# EAGLE design electrovanne (EAGLE 7.6.0)
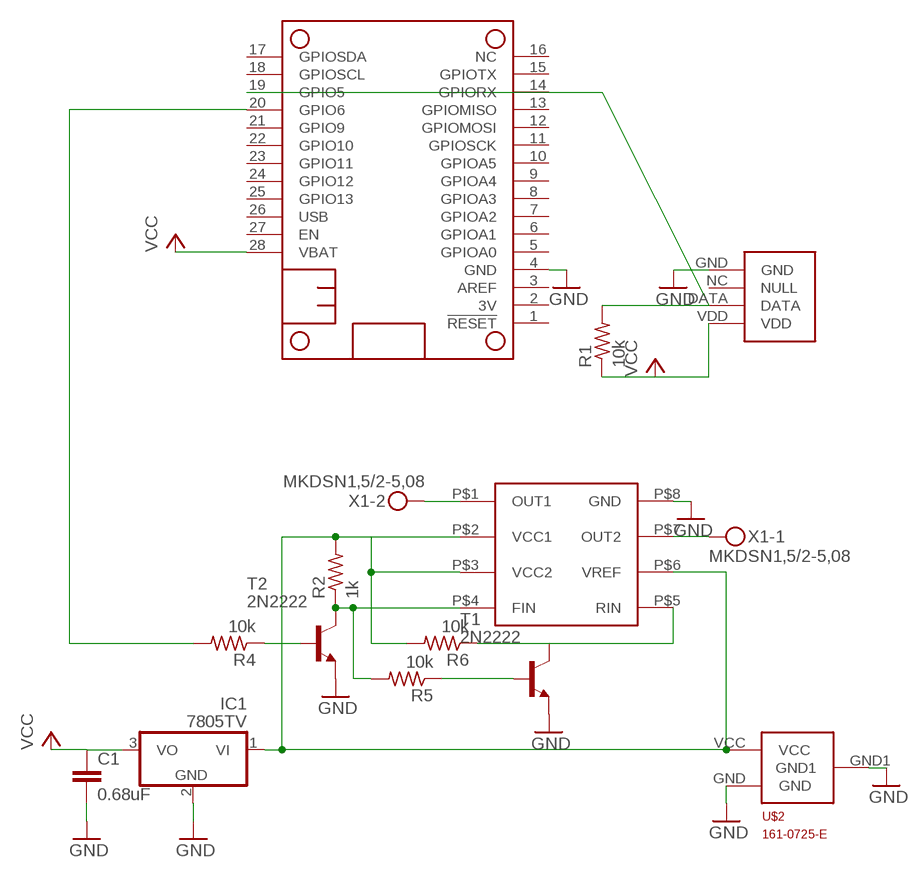
[diagram p0: schematic, sheet 1]

## Parts
C1  0.68uF  CAP0603-CAP  [0603-CAP]
IC1  7805TV  [TO220V]
MS1  FEATHERWING_NODIM  [FEATHERWING_DIM]
R1  10k  R-US_R0603  [R0603]
R2  1k  R-US_R0603  [R0603]
R4  10k  R-US_R0603  [R0603]
R5  10k  R-US_R0603  [R0603]
R6  10k  R-US_R0603  [R0603]
T1  2N2222  [TO18]
T2  2N2222  [TO18]
U$1  DHT22  [DHT22]
U$2  161-0725-E  [161-0725-E]
U$4  755-BD6211F-E2  [755-BD6211F-E2_DIM]
X1  MKDSN1,5/2-5,08  [MKDSN1,5/2-5,08]

## Nets
GND: C1.2 IC1.2(GND) MS1.4(GND) T1.1(E) T2.1(E) U$1.GND U$2.GND U$2.GND1 U$4.P$8(GND)
N$1: IC1.1(VI) R2.2 R6.2 U$2.VCC U$4.P$2(VCC1) U$4.P$3(VCC2) U$4.P$6(VREF)
N$2: R5.1 T1.2(B)
N$3: MS1.19(GPIO5) R1.2 U$1.DATA
N$4: U$4.P$1(OUT1) X1.2
N$6: U$4.P$7(OUT2) X1.1
N$7: MS1.20(GPIO6) R4.2
N$8: R2.1 R5.2 T2.3(C) U$4.P$4(FIN)
N$9: R4.1 T2.2(B)
N$10: R6.1 T1.3(C) U$4.P$5(RIN)
VCC: C1.1 IC1.3(VO) MS1.28(VBAT) R1.1 U$1.VDD
Unconnected: MS1.1(!RESET) MS1.2(3V) MS1.3(AREF) MS1.5(GPIOA0) MS1.6(GPIOA1) MS1.7(GPIOA2) MS1.8(GPIOA3) MS1.9(GPIOA4) MS1.10(GPIOA5) MS1.11(GPIOSCK) MS1.12(GPIOMOSI) MS1.13(GPIOMISO) MS1.14(GPIORX) MS1.15(GPIOTX) MS1.16(NC) MS1.17(GPIOSDA) MS1.18(GPIOSCL) MS1.21(GPIO9) MS1.22(GPIO10) MS1.23(GPIO11) MS1.24(GPIO12) MS1.25(GPIO13) MS1.26(USB) MS1.27(EN) U$1.NC(NULL)

## Library data of the parts
C1 = SparkFun-Capacitors:CAP: Capacitor Standard 0603 ceramic capacitor, and 0.1" leaded capacitor.
IC1 = linear:78*: Positive VOLTAGE REGULATOR Source: http://cache.national.com/ds/LM/LM78L05.pdf http://www.fairchildsemi.com/ds/LM/LM7805.pdf
MS1 = adafruit:FEATHERWING
R1 R2 R4-R6 = resistor:R-US_: RESISTOR, American symbol
T1 T2 = transistor:2N2222: NPN TRANSISTOR
U$1 = Spark:DHT22
U$2 = mouser:161-0725-E
U$4 = mouser:755-BD6211F-E2
X1 = con-phoenix-508:MKDSN1,5/2-5,08: MKDSN 1,5/ 2-5,08 Printklemme Nennstrom: 13,5 A Nennspannung: 250 V Rastermaß: 5,08 mm Polzahl: 2 Anschlussart: Schraubanschluss Montage: Löten Anschlussrichtung Leiter/Platine: 0 ° Artikelnummer: 1729128 Source: http://eshop.phoenixcontact.com .. 1729128.pdf

## Board
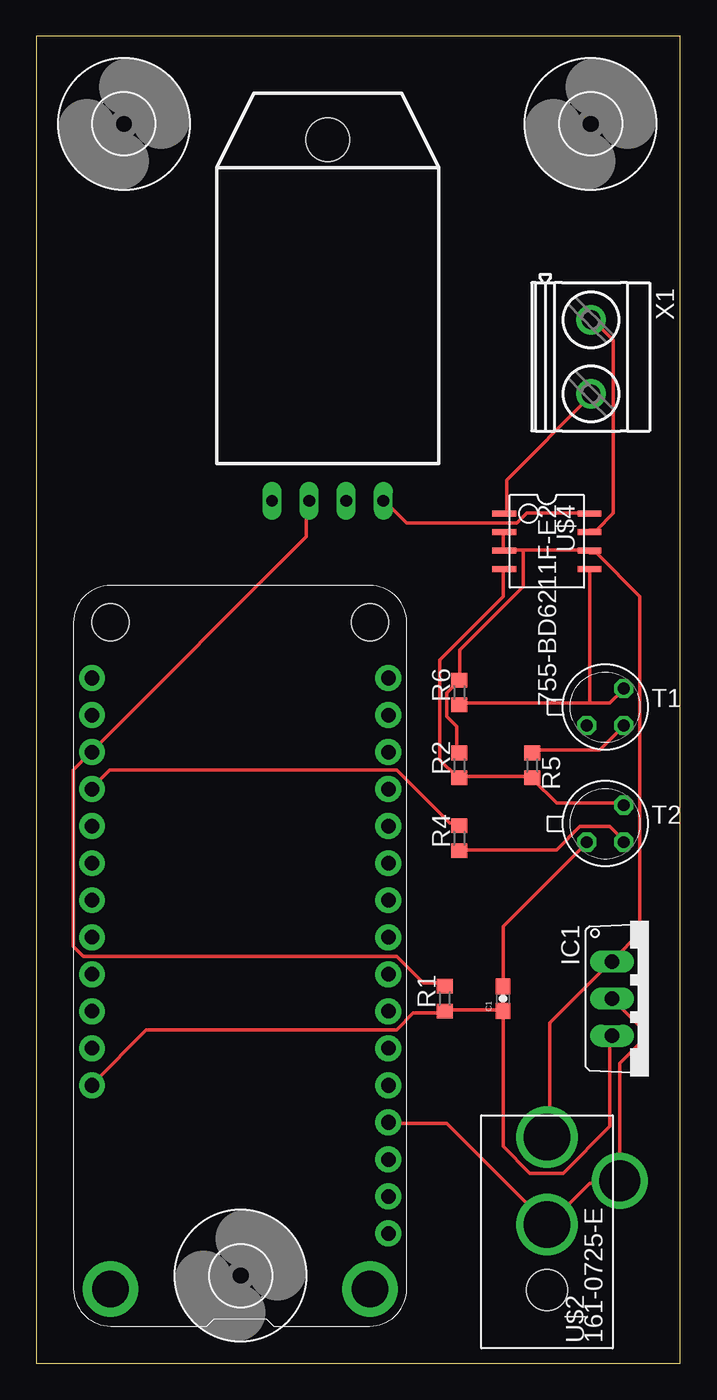
[diagram p1: board, top side]
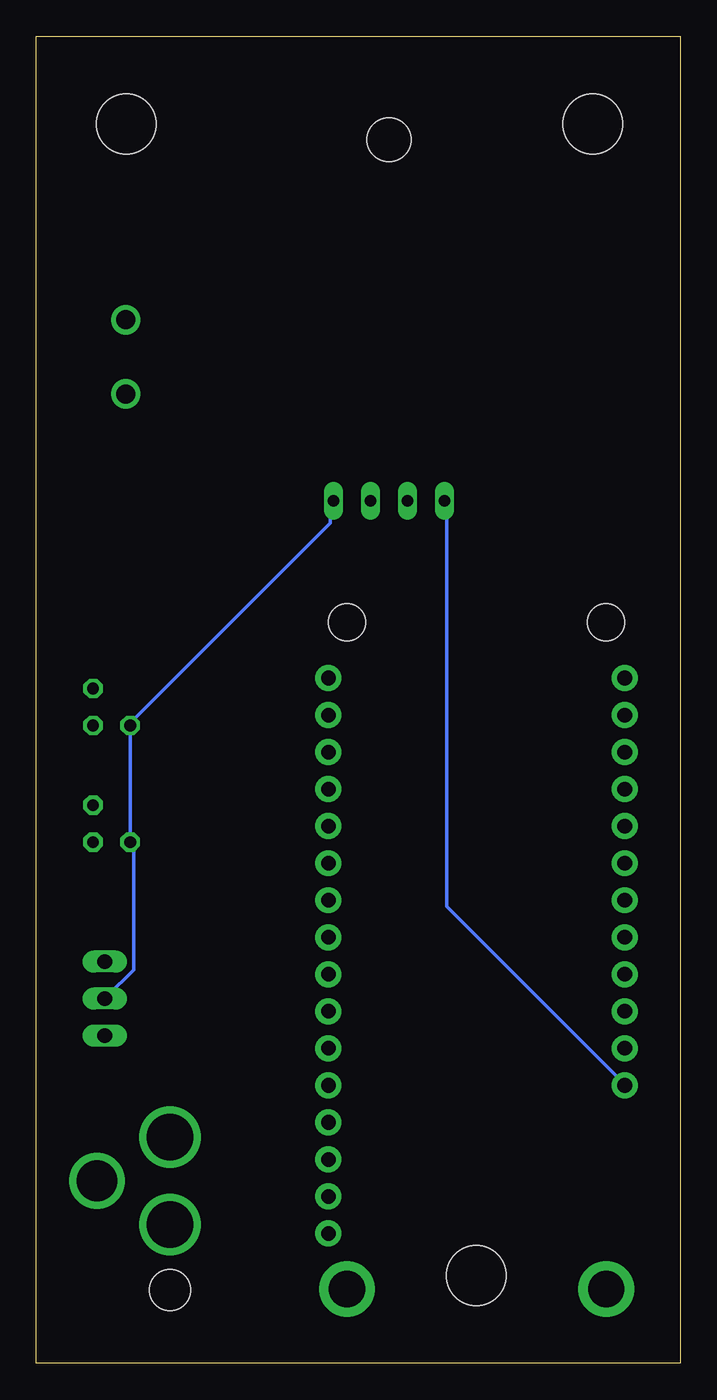
[diagram p2: board, bottom side, seen from below]

Size 44.15 x 91 mm. Coordinates in mm from the lower left corner, seen from the top.
Outline: 0,0 44.15,0 44.15,91 0,91 0,0
Copper layers (1*16): Top 0.035mm / dielectric 1.5mm / Bottom 0.035mm
Design rules "default": minimum track width 10mil, minimum drill 24mil, track to track 8mil, track to pad 8mil, pad to pad 8mil, via to via 8mil, smd to smd 8mil, copper to edge 40mil, drill to drill 8mil, minimum pad ring 10mil, minimum via ring 8mil, stop-mask expansion 4mil, vias tented up to drill 0mil, thermal gap 10mil

### Footprints (pad centres in the part's own frame; a part is rotated, then mirrored left to right if it is on the bottom)
0603-CAP = smd 1.1 x 1: 1 -0.85,0; 2 0.85,0
TO220V = drill 1.016 long: 1 -2.54,-2.54; 2 0,-2.54; 3 2.54,-2.54
FEATHERWING_DIM = drill 1 pad 1.778: 1 6.35,1.27; 2 8.89,1.27; 3 11.43,1.27; 4 13.97,1.27; 5 16.51,1.27; 6 19.05,1.27; 7 21.59,1.27; 8 24.13,1.27; 9 26.67,1.27; 10 29.21,1.27; 11 31.75,1.27; 12 34.29,1.27; 13 36.83,1.27; 14 39.37,1.27; 15 41.91,1.27; 16 44.45,1.27; 17 44.45,21.59; 18 41.91,21.59; 19 39.37,21.59; 20 36.83,21.59; 21 34.29,21.59; 22 31.75,21.59; 23 29.21,21.59; 24 26.67,21.59; 25 24.13,21.59; 26 21.59,21.59; 27 19.05,21.59; 28 16.51,21.59 | drill 2.5 pad 3.81: P$1 2.54,20.32; P$2 2.54,2.54 | hole 2.54: 48.26,20.32; 48.26,2.54
R0603 = smd 1 x 1.1: 1 -0.85,0; 2 0.85,0
TO18 = drill 0.813 octagon: 1 -1.27,-1.27; 2 1.27,-1.27; 3 1.27,1.27
DHT22 = drill 0.8 long: DATA -1.27,0; GND 3.81,0; NC 1.27,0; VDD -3.81,0 | hole 3: 0,24.765
161-0725-E = drill 3.2: GND 0.5,0; VCC 6.5,0 | drill 2.8: GND1 3.5,-5 | hole 2.8: -4,0
4,1 = hole 4.1: 0,0
755-BD6211F-E2_DIM = smd 0.406 x 1.626: P$1 -1.27,-2.921; P$2 0,-2.921; P$3 1.27,-2.921; P$4 2.54,-2.921; P$5 2.54,2.921; P$6 1.27,2.921; P$7 0,2.921; P$8 -1.27,2.921
MKDSN1,5/2-5,08 = drill 1.3 pad 2: 1 -2.561,0.025; 2 2.519,0.025

### Placement (x,y rotation side)
C1  32,25 90 top
IC1  42,25 270 top
MS1  25.4,2.54 90 top
R1  28,25 90 top
R2  29,41 90 top
R4  29,36 90 top
R5  34,41 270 top
R6  29,46 90 top
T1  39,45 0 top
T2  39,37 0 top
U$1  19.97,59.15 0 top
U$2  35,9 90 top
U$3  [4,1]  6,85 0 top
U$4  35,57 270 top
U$5  [4,1]  38,85 0 top
U$6  [4,1]  14,6 0 top
X1  38,69 270 top

### Tracks (layer width: path | path; a pad name or v marks a point on that pad's centre or on a via)
GND
  Top 0.254: MS1.4 24.23,16.46 28.12,16.46 34.98,9.6 U$2.GND 35.2,9.6 37.95,12.34 39.78,12.34 U$2.GND1 40.01,12.57 40.01,20.57 41.38,21.95 41.38,23.09 39.55,24.92 IC1.2 | U$4.P$8 37.72,58.29 33.6,58.29 32.92,57.61 25.38,57.61 24,58.98 U$1.GND | C1.2 32,26.06 32,29.95 37.72,35.66 T2.1
  Bottom 0.254: IC1.2 39.32,25.15 37.49,26.98 37.49,35.43 37.72,35.66 T2.1 37.72,35.89 37.72,43.66 T1.1 37.72,43.89 24,57.61 24,58.98 U$1.GND
N$1
  Top 0.254: R2.2 28.8,42.06 28.8,43.66 28.12,44.35 28.12,45.95 28.8,46.63 R6.2 29.03,46.86 29.03,48.92 33.38,53.26 33.38,55.78 | U$4.P$2 32,56.92 32,55.78 U$4.P$3 32.23,55.78 33.38,55.78 | 33.38,55.78 37.72,55.78 U$4.P$6 37.95,55.55 38.41,55.55 41.38,52.58 41.38,29.49 39.55,27.66 IC1.1 39.32,27.43 35.2,23.32 35.2,15.54 U$2.VCC
N$2
  Top 0.254: R5.1 34.06,42.06 38.63,42.06 40.23,43.66 T1.2
N$3
  Top 0.254: R1.2 27.89,26.06 26.52,26.06 24.69,27.89 3.2,27.89 2.52,28.57 2.52,40.69 3.66,41.83 MS1.19 3.89,42.06 18.52,56.69 18.52,58.98 U$1.DATA
N$4
  Top 0.254: U$4.P$1 32.23,58.29 32.23,60.58 37.95,66.29 X1.2
N$6
  Top 0.254: U$4.P$7 37.95,57.15 38.41,57.15 39.55,58.29 39.55,70.18 38.18,71.55 X1.1
N$7
  Top 0.254: R4.2 28.8,37.03 28.35,37.03 24.69,40.69 5.03,40.69 3.89,39.55 MS1.20
N$8
  Top 0.254: U$4.P$4 32,54.41 32,52.58 27.66,48.23 27.66,41.38 28.8,40.23 R2.1 29.03,40.23 33.83,40.23 R5.2 34.06,40.01 35.66,38.41 40.23,38.41 T2.3
N$9
  Top 0.254: R4.1 29.03,35.2 35.66,35.2 37.26,36.8 39.32,36.8 40.23,35.89 T2.2
N$10
  Top 0.254: 37.95,45.26 39.32,45.26 40.23,46.18 T1.3 | 37.95,45.26 29.03,45.26 R6.1 | 37.95,45.26 37.95,54.41 U$4.P$5
VCC
  Top 0.254: IC1.3 39.32,22.4 39.32,16.23 36.12,13.03 33.83,13.03 32,14.86 32,24 C1.1 31.77,24.23 28.12,24.23 R1.1 27.89,24 25.83,24 24.69,22.86 7.54,22.86 3.89,19.2 MS1.28
  Bottom 0.254: U$1.VDD 16,58.98 16,31.32 3.89,19.2 MS1.28